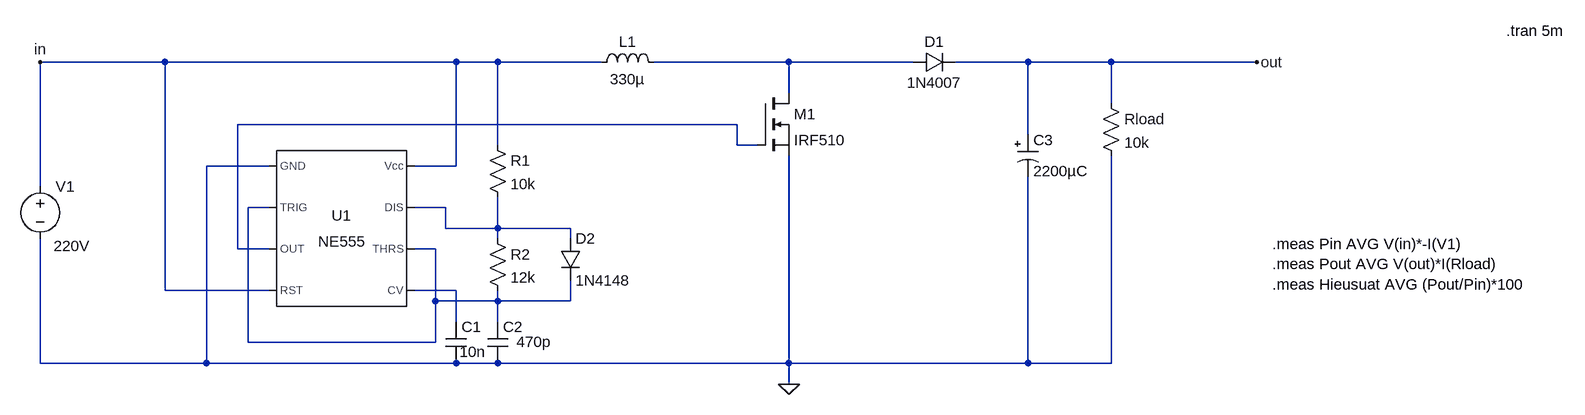
[diagram p0: schematic mach boost ne555.asc]
mach boost ne555.asc, the LTspice schematic file:
Version 4
SHEET 1 2252 680
WIRE -80 -80 -272 -80
WIRE 368 -80 -80 -80
WIRE 432 -80 368 -80
WIRE 592 -80 432 -80
WIRE 880 -80 672 -80
WIRE 1072 -80 880 -80
WIRE 1248 -80 1136 -80
WIRE 1376 -80 1248 -80
WIRE 1600 -80 1376 -80
WIRE 880 -32 880 -80
WIRE 1376 -16 1376 -80
WIRE 800 16 32 16
WIRE 1248 32 1248 -80
WIRE 432 48 432 -80
WIRE 800 48 800 16
WIRE 832 48 800 48
WIRE 80 80 -16 80
WIRE 368 80 368 -80
WIRE 368 80 304 80
WIRE -272 112 -272 -80
WIRE 80 144 48 144
WIRE 352 144 304 144
WIRE 352 176 352 144
WIRE 432 176 432 128
WIRE 432 176 352 176
WIRE 544 176 432 176
WIRE 432 192 432 176
WIRE 544 192 544 176
WIRE 32 208 32 16
WIRE 80 208 32 208
WIRE 336 208 304 208
WIRE -80 272 -80 -80
WIRE 80 272 -80 272
WIRE 368 272 304 272
WIRE 336 288 336 208
WIRE 432 288 432 272
WIRE 432 288 336 288
WIRE 544 288 544 256
WIRE 544 288 432 288
WIRE 368 320 368 272
WIRE 432 320 432 288
WIRE 48 352 48 144
WIRE 336 352 336 288
WIRE 336 352 48 352
WIRE -272 384 -272 192
WIRE -16 384 -16 80
WIRE -16 384 -272 384
WIRE 368 384 -16 384
WIRE 432 384 368 384
WIRE 880 384 880 64
WIRE 880 384 432 384
WIRE 1248 384 1248 96
WIRE 1248 384 880 384
WIRE 1376 384 1376 64
WIRE 1376 384 1248 384
WIRE 880 416 880 384
FLAG 880 416 0
FLAG -272 -80 in
FLAG 1600 -80 out
SYMBOL Misc\\NE555 192 176 R0
SYMATTR InstName U1
SYMBOL cap 416 320 R0
WINDOW 3 45 31 Left 2
SYMATTR Value 470p
SYMATTR InstName C2
SYMBOL res 416 32 R0
SYMATTR InstName R1
SYMATTR Value 10k
SYMBOL res 416 176 R0
SYMATTR InstName R2
SYMATTR Value 12k
SYMBOL ind 688 -64 M270
WINDOW 0 32 56 VTop 2
WINDOW 3 5 56 VBottom 2
SYMATTR InstName L1
SYMATTR Value 330µ
SYMBOL diode 1072 -64 R270
WINDOW 0 32 32 VTop 2
WINDOW 3 0 32 VBottom 2
SYMATTR InstName D1
SYMATTR Value 1N4007
SYMBOL diode 528 192 R0
SYMATTR InstName D2
SYMATTR Value 1N4148
SYMBOL voltage -272 96 R0
WINDOW 123 0 0 Left 0
WINDOW 39 0 0 Left 0
WINDOW 3 21 107 Left 2
SYMATTR Value 220V
SYMATTR InstName V1
SYMBOL cap 352 320 R0
WINDOW 3 21 46 Left 2
SYMATTR Value 10n
SYMATTR InstName C1
SYMBOL res 1360 -32 R0
SYMATTR InstName Rload
SYMATTR Value 10k
SYMBOL polcap 1232 32 R0
SYMATTR InstName C3
SYMATTR Value 2200µC
SYMBOL nmos 832 -32 R0
SYMATTR InstName M1
SYMATTR Value IRF510
TEXT 1984 -128 Left 2 !.tran 5m
TEXT 1624 200 Left 2 !.meas Pin AVG V(in)*-I(V1)\n.meas Pout AVG V(out)*I(Rload)\n.meas Hieusuat AVG (Pout/Pin)*100

The netlist it stands for:
* mach boost ne555.asc
XU1 0 N003 N002 in N005 N003 N004 in NE555  ; pins GND TRIG OUT RST CV THRS DIS Vcc
C2 N003 0 470p
R1 in N004 10k
R2 N004 N003 12k
L1 N001 in 330µ
D1 N001 out 1N4007
D2 N004 N003 1N4148
V1 in 0 220V
C1 N005 0 10n
Rload out 0 10k
C3 out 0 2200µC
M1 N001 N002 0 0 IRF510
.model D D
.lib standard.dio
.model NMOS NMOS
.model PMOS PMOS
.lib standard.mos
.tran 5m
.meas Pin AVG V(in)*-I(V1)
.meas Pout AVG V(out)*I(Rload)
.meas Hieusuat AVG (Pout/Pin)*100
.lib NE555.sub
.backanno
.end